# Altium schematic sheet MT9V034.SchDoc
size A4; SheetNumber: 1; SheetTotal: 3
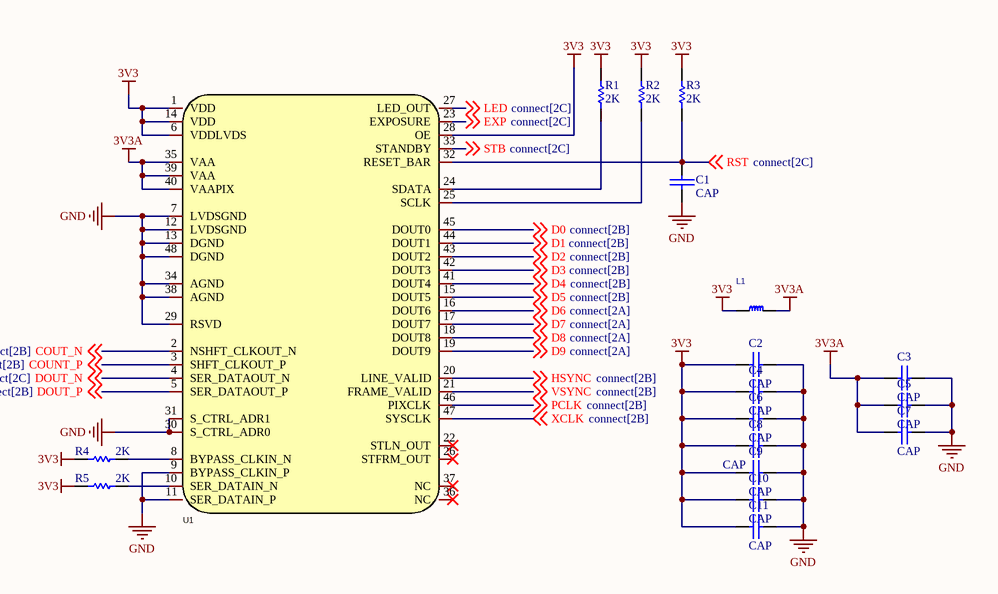
[diagram p0: MT9V034.SchDoc]

## Parts
C1  CAP  [C0603]
C2  CAP  [C0603]
C3  CAP  [C0603]
C4  CAP  [C0603]
C5  CAP  [C0603]
C6  CAP  [C0603]
C7  CAP  [C0603]
C8  CAP  [C0603]
C9  CAP  [C0603]
C10  CAP  [C0603]
C11  CAP  [C0603]
L1  FB  [L0603]  (value not drawn)
R1  2K  [R0603]
R2  2K  [R0603]
R3  2K  [R0603]
R4  2K  [R0603]
R5  2K  [R0603]
U1  MT9V034C12STM-DP  [CLCC-48_L11.4-W11.4-P0.80-T]  (value not drawn)

## Nets
3V3: C2.1 C4.1 C6.1 C8.1 C9.1 C10.1 C11.1 L1.1 R1.2 R2.2 R3.2 R4.1 R5.1 U1.1(VDD) U1.6(VDDLVDS) U1.14(VDD) U1.28(OE)
3V3A: C3.1 C5.1 C7.1 L1.2 U1.35(VAA) U1.39(VAA) U1.40(VAAPIX)
GND: C1.1 C2.2 C3.2 C4.2 C5.2 C6.2 C7.2 C8.2 C9.2 C10.2 C11.2 U1.7(LVDSGND) U1.9(BYPASS_CLKIN_P) U1.11(SER_DATAIN_P) U1.12(LVDSGND) U1.13(DGND) U1.29(RSVD) U1.30(S_CTRL_ADR0) U1.31(S_CTRL_ADR1) U1.34(AGND) U1.38(AGND) U1.48(DGND)
COUNT_P: U1.3(SHFT_CLKOUT_P) ; off-sheet COUNT_P
COUT_N: U1.2(NSHFT_CLKOUT_N) ; off-sheet COUT_N
D0: U1.45(DOUT0) ; off-sheet D0
D1: U1.44(DOUT1) ; off-sheet D1
D2: U1.43(DOUT2) ; off-sheet D2
D3: U1.42(DOUT3) ; off-sheet D3
D4: U1.41(DOUT4) ; off-sheet D4
D5: U1.15(DOUT5) ; off-sheet D5
D6: U1.16(DOUT6) ; off-sheet D6
D7: U1.17(DOUT7) ; off-sheet D7
D8: U1.18(DOUT8) ; off-sheet D8
D9: U1.19(DOUT9) ; off-sheet D9
DOUT_N: U1.4(SER_DATAOUT_N) ; off-sheet DOUT_N
DOUT_P: U1.5(SER_DATAOUT_P) ; off-sheet DOUT_P
EXP: U1.23(EXPOSURE) ; off-sheet EXP
HSYNC: U1.20(LINE_VALID) ; off-sheet HSYNC
LED: U1.27(LED_OUT) ; off-sheet LED
PCLK: U1.46(PIXCLK) ; off-sheet PCLK
RST: C1.2 R3.1 U1.32(RESET_BAR) ; off-sheet RST
STB: U1.33(STANDBY) ; off-sheet STB
VSYNC: U1.21(FRAME_VALID) ; off-sheet VSYNC
XCLK: U1.47(SYSCLK) ; off-sheet XCLK
NetR1_1: R1.1 U1.24(SDATA)
NetR2_1: R2.1 U1.25(SCLK)
NetR4_2: R4.2 U1.8(BYPASS_CLKIN_N)
NetR5_2: R5.2 U1.10(SER_DATAIN_N)

Not connected (* = marked no-connect by the designer): U1 22(STLN_OUT)* 26(STFRM_OUT)* 36(NC)* 37(NC)*

## Library data of the parts
C1-C11 = CAP: 无极性电容
L1 = FB: 铁氧体磁珠
R1-R5 = RES: 电阻
U1 = MT9V034C12STM-DP: Manufacturer: onsemi(安森美); Add into BOM: yes; Name: MT9V034C12STM-DP; Symbol: MT9V034C12STM-DP; Device: MT9V034C12STM-DP; LCSC Part Name: MT9V034C12STM-DP; Supplier Part: C900584; Manufacturer Part: MT9V034C12STM-DP; Supplier Footprint: -; JLCPCB Part Class: Extended Part; Datasheet: https://atta.szlcsc.com/upload/public/pdf/source/20200824/C603338_B5C66803071D17F0CA3570A7C18C49F1.pdf; Supplier: LCSC; Convert to PCB: yes